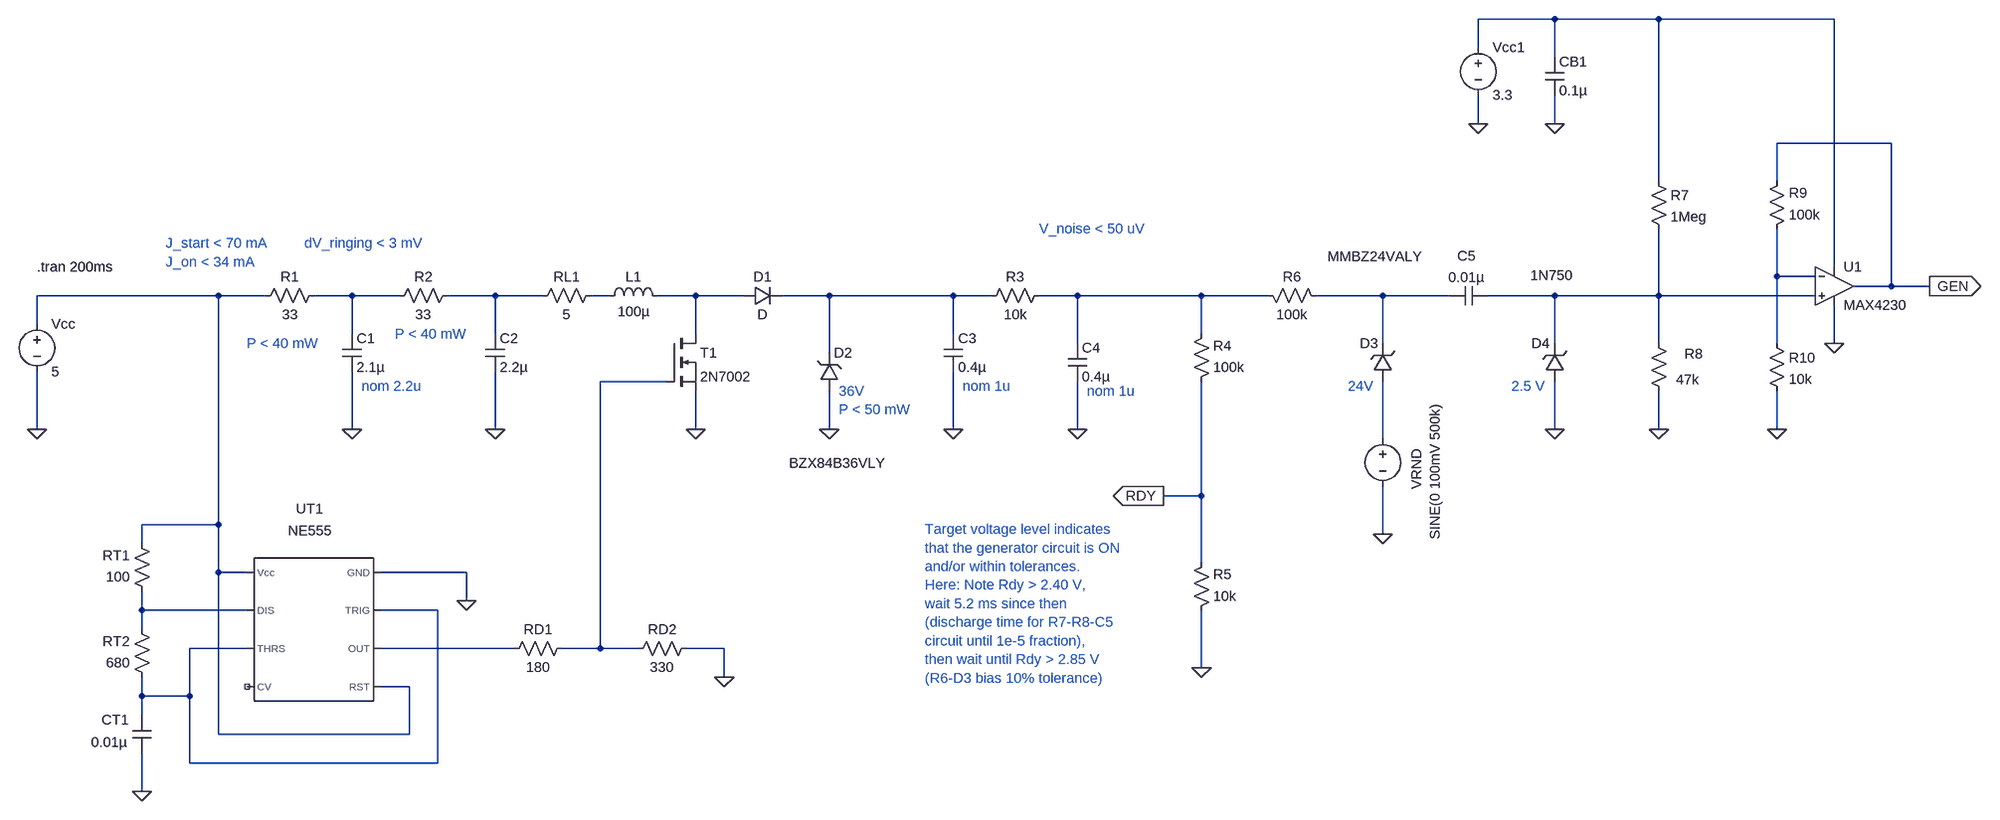
[diagram p0: schematic BoostPump11_WaveExtractor.asc]
BoostPump11_WaveExtractor.asc, the LTspice schematic file:
Version 4
SHEET 1 4340 772
WIRE 1840 -544 1712 -544
WIRE 2048 -544 1840 -544
WIRE 2352 -544 2048 -544
WIRE 1712 -496 1712 -544
WIRE 1840 -480 1840 -544
WIRE 1712 -368 1712 -416
WIRE 1840 -368 1840 -416
WIRE 2448 -336 2256 -336
WIRE 2048 -272 2048 -544
WIRE 2256 -272 2256 -336
WIRE 2352 -128 2352 -544
WIRE 2256 -112 2256 -192
WIRE 2320 -112 2256 -112
WIRE 2448 -96 2448 -336
WIRE 2448 -96 2384 -96
WIRE 2512 -96 2448 -96
WIRE -400 -80 -704 -80
WIRE -320 -80 -400 -80
WIRE -176 -80 -240 -80
WIRE -96 -80 -176 -80
WIRE 64 -80 -16 -80
WIRE 144 -80 64 -80
WIRE 256 -80 224 -80
WIRE 400 -80 336 -80
WIRE 480 -80 400 -80
WIRE 624 -80 544 -80
WIRE 832 -80 624 -80
WIRE 896 -80 832 -80
WIRE 1040 -80 976 -80
WIRE 1248 -80 1040 -80
WIRE 1360 -80 1248 -80
WIRE 1552 -80 1440 -80
WIRE 1664 -80 1552 -80
WIRE 1840 -80 1728 -80
WIRE 2048 -80 2048 -192
WIRE 2048 -80 1840 -80
WIRE 2320 -80 2048 -80
WIRE -704 -32 -704 -80
WIRE -176 -16 -176 -80
WIRE 64 -16 64 -80
WIRE 400 -16 400 -80
WIRE 832 -16 832 -80
WIRE 1248 -16 1248 -80
WIRE 1040 0 1040 -80
WIRE 1552 0 1552 -80
WIRE 1840 0 1840 -80
WIRE 2048 0 2048 -80
WIRE 2256 0 2256 -112
WIRE 2352 0 2352 -64
WIRE 624 16 624 -80
WIRE 352 64 240 64
WIRE -704 144 -704 48
WIRE -176 144 -176 48
WIRE 64 144 64 48
WIRE 400 144 400 80
WIRE 624 144 624 80
WIRE 832 144 832 48
WIRE 1040 144 1040 64
WIRE 1840 144 1840 64
WIRE 2048 144 2048 80
WIRE 2256 144 2256 80
WIRE 1552 160 1552 64
WIRE 1248 256 1248 64
WIRE 1248 256 1184 256
WIRE -400 304 -400 -80
WIRE -400 304 -528 304
WIRE 1552 320 1552 240
WIRE -528 336 -528 304
WIRE 1248 368 1248 256
WIRE -400 384 -400 304
WIRE -352 384 -400 384
WIRE 16 384 -128 384
WIRE 16 432 16 384
WIRE -528 448 -528 416
WIRE -352 448 -528 448
WIRE -32 448 -128 448
WIRE -528 480 -528 448
WIRE -352 512 -448 512
WIRE 96 512 -128 512
WIRE 240 512 240 64
WIRE 240 512 176 512
WIRE 304 512 240 512
WIRE 448 512 384 512
WIRE 1248 544 1248 448
WIRE 448 560 448 512
WIRE -80 576 -128 576
WIRE -528 592 -528 560
WIRE -448 592 -448 512
WIRE -448 592 -528 592
WIRE -528 624 -528 592
WIRE -400 656 -400 384
WIRE -80 656 -80 576
WIRE -80 656 -400 656
WIRE -448 704 -448 592
WIRE -32 704 -32 448
WIRE -32 704 -448 704
WIRE -528 752 -528 688
FLAG 64 144 0
FLAG 400 144 0
FLAG 832 144 0
FLAG -704 144 0
FLAG 624 144 0
FLAG 1040 144 0
FLAG -176 144 0
FLAG -528 752 0
FLAG 16 432 0
FLAG 448 560 0
FLAG 2352 0 0
FLAG 1712 -368 0
FLAG 1840 -368 0
FLAG 2512 -96 GEN
IOPIN 2512 -96 Out
FLAG 1248 544 0
FLAG 1184 256 RDY
IOPIN 1184 256 Out
FLAG 1552 320 0
FLAG 2048 144 0
FLAG 2256 144 0
FLAG 1840 144 0
SYMBOL res 0 -96 R90
WINDOW 0 0 56 VBottom 2
WINDOW 3 32 56 VTop 2
SYMATTR InstName R2
SYMATTR Value 33
SYMBOL res 240 -96 R90
WINDOW 0 0 56 VBottom 2
WINDOW 3 32 56 VTop 2
SYMATTR InstName RL1
SYMATTR Value 5
SYMBOL cap 48 -16 R0
SYMATTR InstName C2
SYMATTR Value 2.2µ
SYMBOL cap 816 -16 R0
SYMATTR InstName C3
SYMATTR Value 0.4µ
SYMBOL ind 240 -64 R270
WINDOW 0 32 56 VTop 2
WINDOW 3 5 56 VBottom 2
SYMATTR InstName L1
SYMATTR Value 100µ
SYMBOL diode 480 -64 R270
WINDOW 0 32 32 VTop 2
WINDOW 3 0 32 VBottom 2
SYMATTR InstName D1
SYMBOL nmos 352 -16 R0
SYMATTR InstName T1
SYMATTR Value 2N7002
SYMBOL voltage -704 -48 R0
WINDOW 123 0 0 Left 0
WINDOW 39 0 0 Left 0
SYMATTR InstName Vcc
SYMATTR Value 5
SYMBOL res 992 -96 R90
WINDOW 0 0 56 VBottom 2
WINDOW 3 32 56 VTop 2
SYMATTR InstName R3
SYMATTR Value 10k
SYMBOL zener 1568 64 R180
WINDOW 0 24 64 Left 2
WINDOW 3 -50 210 Left 2
SYMATTR InstName D3
SYMATTR Value MMBZ24VALY
SYMBOL cap -192 -16 R0
SYMATTR InstName C1
SYMATTR Value 2.1µ
SYMBOL res -224 -96 R90
WINDOW 0 0 56 VBottom 2
WINDOW 3 32 56 VTop 2
SYMATTR InstName R1
SYMATTR Value 33
SYMBOL Misc\\NE555 -240 480 M0
WINDOW 0 7 -202 Center 2
WINDOW 3 6 -166 Center 2
SYMATTR InstName UT1
SYMBOL cap -544 624 R0
WINDOW 0 -52 8 Left 2
WINDOW 3 -69 45 Left 2
SYMATTR InstName CT1
SYMATTR Value 0.01µ
SYMBOL res -512 576 R180
WINDOW 0 36 76 Left 2
WINDOW 3 36 40 Left 2
SYMATTR InstName RT2
SYMATTR Value 680
SYMBOL res 192 496 R90
WINDOW 0 0 56 VBottom 2
WINDOW 3 32 56 VTop 2
SYMATTR InstName RD1
SYMATTR Value 180
SYMBOL res 400 496 R90
WINDOW 0 0 56 VBottom 2
WINDOW 3 32 56 VTop 2
SYMATTR InstName RD2
SYMATTR Value 330
SYMBOL res -512 432 R180
WINDOW 0 36 76 Left 2
WINDOW 3 36 40 Left 2
SYMATTR InstName RT1
SYMATTR Value 100
SYMBOL zener 608 80 M180
WINDOW 0 24 64 Left 2
WINDOW 3 -51 -121 Left 2
SYMATTR InstName D2
SYMATTR Value BZX84B36VLY
SYMBOL cap 1024 0 R0
SYMATTR InstName C4
SYMATTR Value 0.4µ
SYMBOL voltage 1552 144 M0
WINDOW 123 0 0 Left 0
WINDOW 39 0 0 Left 0
WINDOW 0 -57 101 VLeft 2
WINDOW 3 -88 186 VLeft 2
SYMATTR InstName VRND
SYMATTR Value SINE(0 100mV 500k)
SYMBOL cap 1728 -96 R90
WINDOW 0 -35 36 VBottom 2
WINDOW 3 -30 36 VTop 2
SYMATTR InstName C5
SYMATTR Value 0.01µ
SYMBOL OpAmps\\MAX4230 2352 -160 R0
SYMATTR InstName U1
SYMBOL res 2032 -288 R0
SYMATTR InstName R7
SYMATTR Value 1Meg
SYMBOL res 2240 -176 M180
WINDOW 0 36 76 Left 2
WINDOW 3 36 40 Left 2
SYMATTR InstName R9
SYMATTR Value 100k
SYMBOL voltage 1712 -512 R0
WINDOW 123 0 0 Left 0
WINDOW 39 0 0 Left 0
SYMATTR InstName Vcc1
SYMATTR Value 3.3
SYMBOL cap 1824 -480 R0
SYMATTR InstName CB1
SYMATTR Value 0.1µ
SYMBOL res 1456 -64 M270
WINDOW 0 32 56 VTop 2
WINDOW 3 0 56 VBottom 2
SYMATTR InstName R6
SYMATTR Value 100k
SYMBOL res 1232 464 M180
WINDOW 0 36 76 Left 2
WINDOW 3 36 40 Left 2
SYMATTR InstName R5
SYMATTR Value 10k
SYMBOL res 1232 80 M180
WINDOW 0 36 76 Left 2
WINDOW 3 36 40 Left 2
SYMATTR InstName R4
SYMATTR Value 100k
SYMBOL res 2240 -16 R0
SYMATTR InstName R10
SYMATTR Value 10k
SYMBOL res 2064 96 R180
WINDOW 0 -58 78 Left 2
WINDOW 3 -52 35 Left 2
SYMATTR InstName R8
SYMATTR Value 47k
SYMBOL zener 1856 64 R180
WINDOW 0 24 64 Left 2
WINDOW 3 -15 178 Left 2
SYMATTR InstName D4
SYMATTR Value 1N750
TEXT -704 -128 Left 2 !.tran 200ms
TEXT -256 -168 Left 2 ;dV_ringing < 3 mV
TEXT 976 -192 Left 2 ;V_noise < 50 uV
TEXT 640 80 Left 2 ;36V\nP < 50 mW
TEXT 1536 72 Right 2 ;24V
TEXT 784 312 Left 2 ;Target voltage level indicates\nthat the generator circuit is ON\nand/or within tolerances.\nHere: Note Rdy > 2.40 V,\nwait 5.2 ms since then\n(discharge time for R7-R8-C5\ncircuit until 1e-5 fraction),\nthen wait until Rdy > 2.85 V\n(R6-D3 bias 10% tolerance)
TEXT -160 72 Left 2 ;nom 2.2u
TEXT 848 72 Left 2 ;nom 1u
TEXT 1056 80 Left 2 ;nom 1u
TEXT 1768 72 Left 2 ;2.5 V
TEXT -488 -168 Left 2 ;J_start < 70 mA\nJ_on < 34 mA
TEXT -352 0 Left 2 ;P < 40 mW
TEXT -104 -16 Left 2 ;P < 40 mW

The netlist it stands for:
* BoostPump11_WaveExtractor.asc
R2 N005 N004 33
RL1 N006 N005 5
C2 N005 0 2.2µ
C3 N008 0 0.4µ
L1 N006 N007 100µ
D1 N007 N008 D
M§T1 N007 N012 0 0 2N7002
Vcc N003 0 5
R3 N009 N008 10k
D3 N013 N010 MMBZ24VALY
C1 N004 0 2.1µ
R1 N004 N003 33
XUT1 0 N015 N016 N003 NC_01 N015 N014 N003 NE555  ; pins GND TRIG OUT RST CV THRS DIS Vcc
CT1 N015 0 0.01µ
RT2 N015 N014 680
RD1 N012 N016 180
RD2 0 N012 330
RT1 N014 N003 100
D2 0 N008 BZX84B36VLY
C4 N009 0 0.4µ
VRND N013 0 SINE(0 100mV 500k)
C5 N011 N010 0.01µ
XU1 N011 N002 N001 0 GEN MAX4230  ; pins In+ In- V+ V- OUT
R7 N001 N011 1Meg
R9 N002 GEN 100k
Vcc1 N001 0 3.3
CB1 N001 0 0.1µ
R6 N010 N009 100k
R5 0 RDY 10k
R4 RDY N009 100k
R10 N002 0 10k
R8 0 N011 47k
D4 0 N011 1N750
.model D D
.lib standard.dio
.model NMOS NMOS
.model PMOS PMOS
.lib standard.mos
.tran 200ms
* dV_ringing < 3 mV
* V_noise < 50 uV
* 36V
* P < 50 mW
* 24V
* Target voltage level indicates
* that the generator circuit is ON
* and/or within tolerances.
* Here: Note Rdy > 2.40 V,
* wait 5.2 ms since then
* (discharge time for R7-R8-C5
* circuit until 1e-5 fraction),
* then wait until Rdy > 2.85 V
* (R6-D3 bias 10% tolerance)
* nom 2.2u
* nom 1u
* nom 1u
* 2.5 V
* J_start < 70 mA
* J_on < 34 mA
* P < 40 mW
* P < 40 mW
.lib NE555.sub
.lib MAX4230.lib
.backanno
.end